# EAGLE design NinjaPCB_ver2.0 (EAGLE 6.6.0)
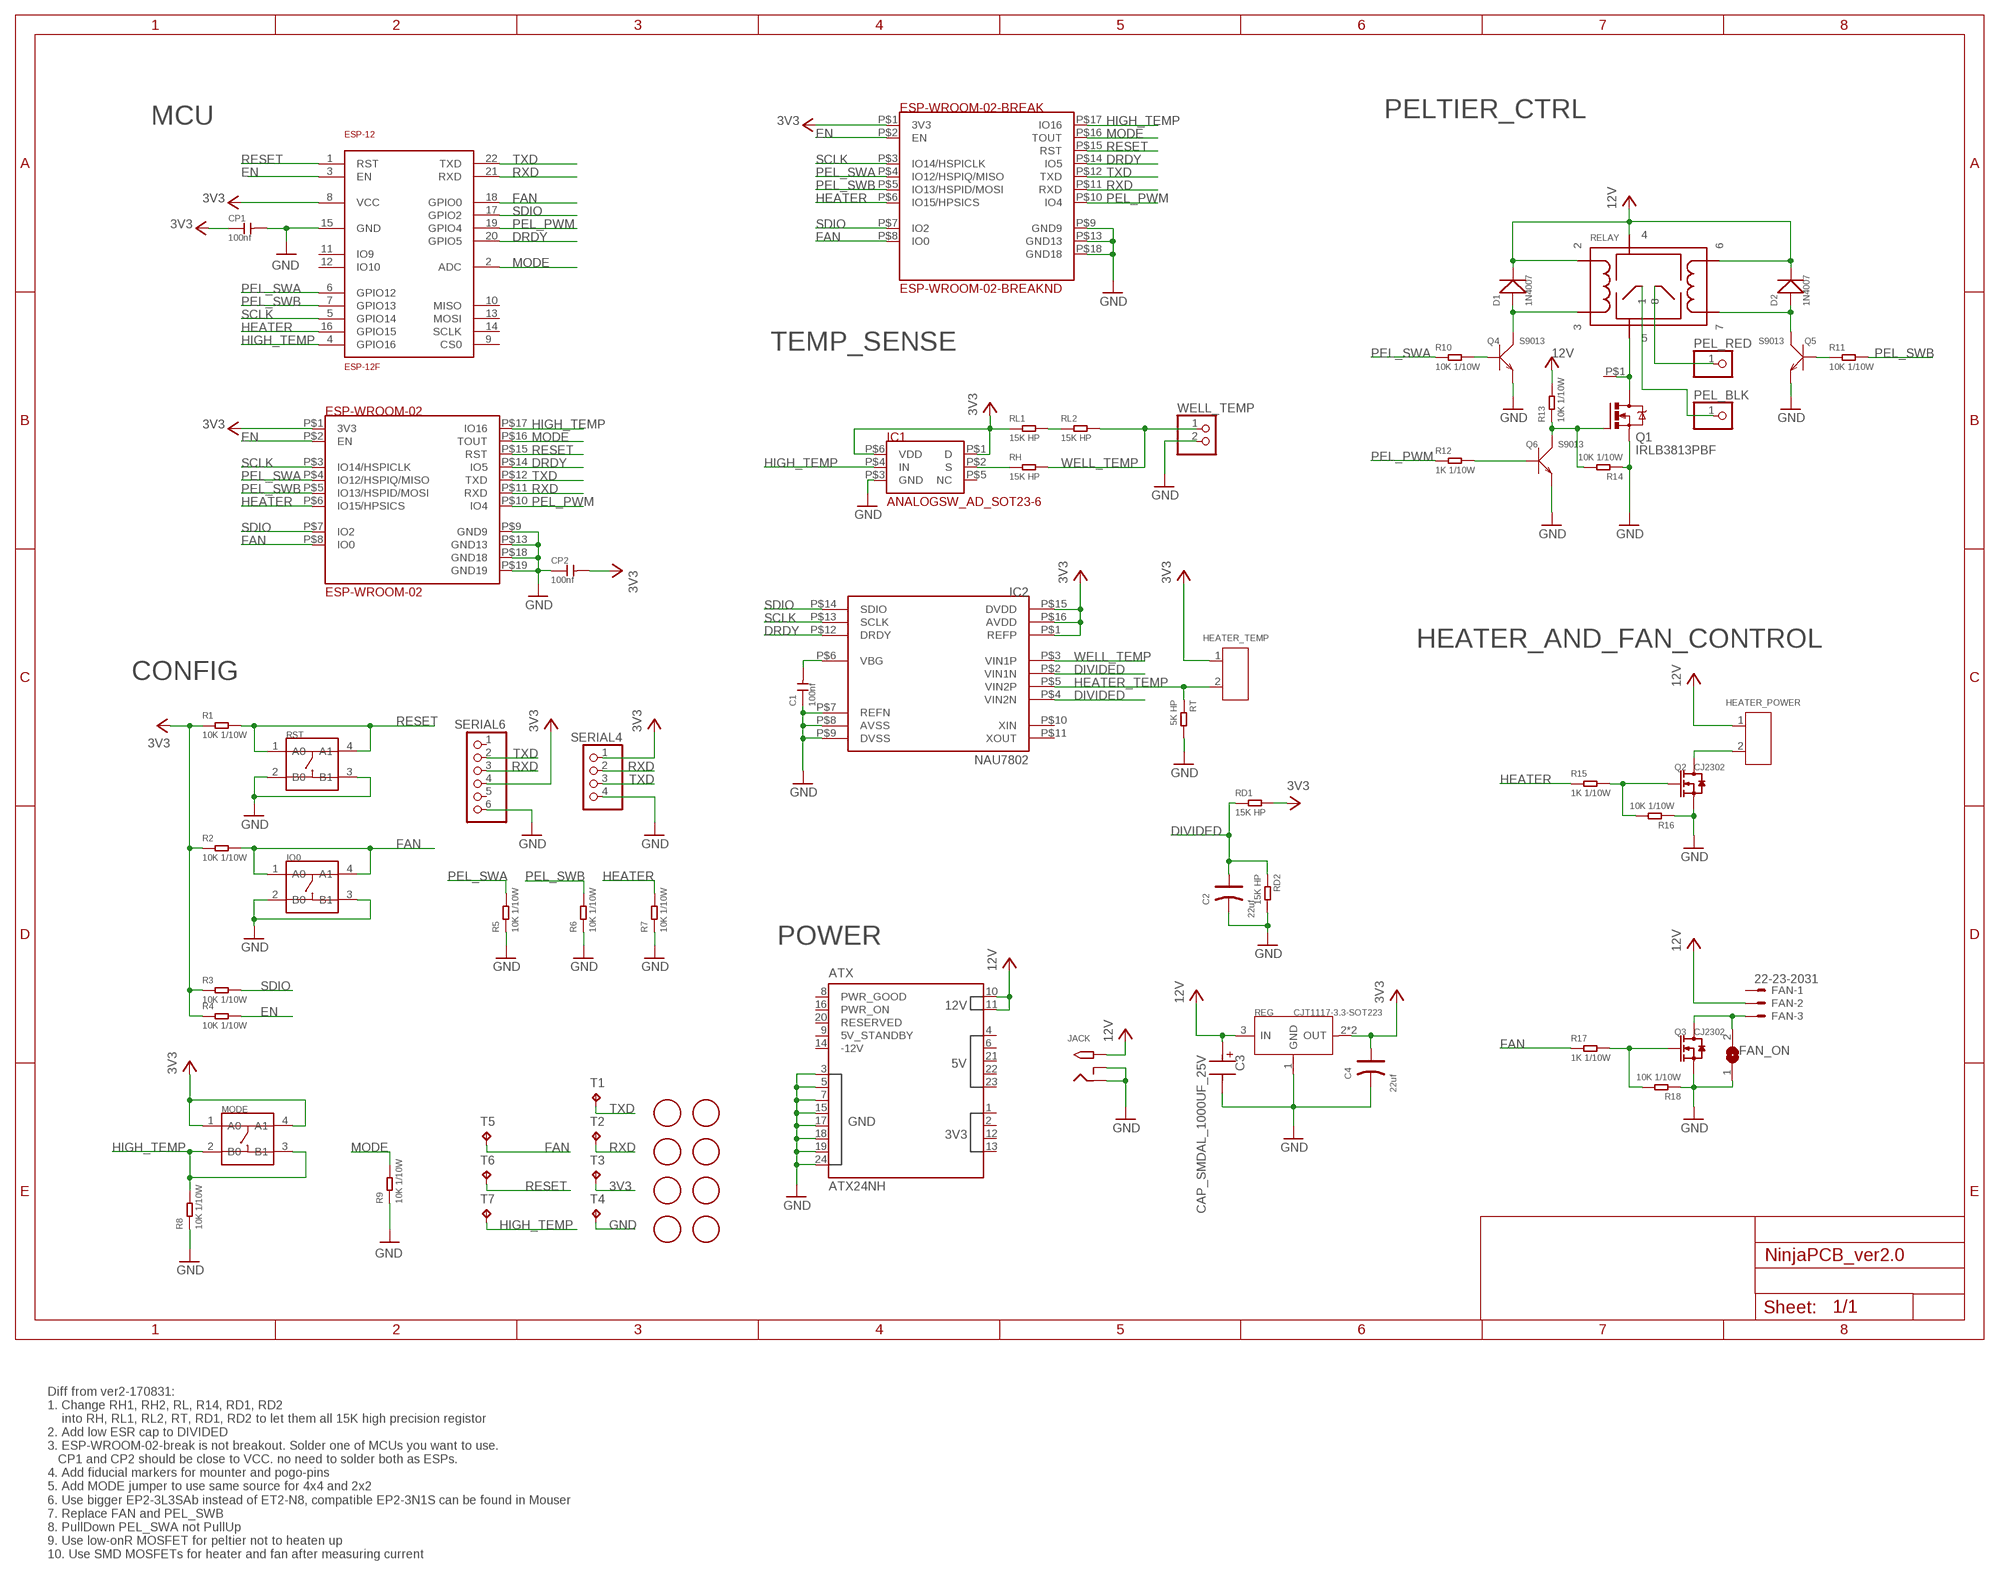
[diagram p0: schematic, sheet 1]

## Parts
ATX  ATX24NH  [ATX24]
C1  100nf  CERAMIC-100NF-50V-10%-X7R(0603)  [C0603]
C2  22uf  TANTALUM-SMD-22UF-16V(AVX-B)  [AVX-B]
C3  CAP_SMDAL_1000UF_25V  [CAP_SMD_AL_D125]
C4  22uf  TANTALUM-SMD-22UF-16V(AVX-B)  [AVX-B]
CP1  100nf  CERAMIC-100NF-50V-10%-X7R(0603)  [C0603]
CP2  100nf  CERAMIC-100NF-50V-10%-X7R(0603)  [C0603]
D1  1N4007  DIODE-GEN-PURPOSE-1KV-1A(DO-214AC)  [DO-214AC]
D2  1N4007  DIODE-GEN-PURPOSE-1KV-1A(DO-214AC)  [DO-214AC]
ESP-12  ESP-12F  [ESP-12F]
ESP-WROOM-02  ESP-WROOM-02  [ESP-WROOM-02]
ESP-WROOM-02-BREAK  ESP-WROOM-02-BREAKND  [ESP-WROOM-02-BREAK-NODETAIL]
FAN  22-23-2031  [22-23-2031]
FAN_ON  SJ  [SJ]
HEATER_POWER  SCREW-TERMINAL-GREEN(2P-3.5)  [H2-3.5-7.0X7.0MM]
HEATER_TEMP  SCREW-TERMINAL-GREEN(2P-3.5)  [H2-3.5-7.0X7.0MM]
HEATSINK  HEAT111PB015  [HEAT11PB015]
IC1  ANALOGSW_AD_SOT23-6  [SOT-23-6]
IC2  NAU7802  [SOP-16]
IO0  DIP-SWITCH-TACTILE-SPST-NO/TS-1109(4P-D6.0MM)'TS-1109'  [SW4-6.0X6.0X5.0MM]
JACK  2.1MMJACKTHM-NOOUT  [PJ-102A-NOOUT]
MODE  DIP-SWITCH-TACTILE-SPST-NO/TS-1109(4P-D6.0MM)'TS-1109'  [SW4-6.0X6.0X5.0MM]
PEL_BLK  PINHD-1X1L  [1X01LONG]
PEL_RED  PINHD-1X1L  [1X01LONG]
Q1  IRLB3813PBF  IRF520  [TO220BV]
Q2  CJ2302  SMD-MOSFET-N-CH-20V-2.1A-CJ2302(SOT-23)  [SOT-23]
Q3  CJ2302  SMD-MOSFET-N-CH-20V-2.1A-CJ2302(SOT-23)  [SOT-23]
Q4  S9013  SMD-TRANSISTORS-NPN-25V-500MA-S9013(SOT-23)  [SOT-23]
Q5  S9013  SMD-TRANSISTORS-NPN-25V-500MA-S9013(SOT-23)  [SOT-23]
Q6  S9013  SMD-TRANSISTORS-NPN-25V-500MA-S9013(SOT-23)  [SOT-23]
R1  10K 1/10W  SMD-RES-10K-5%-1/10W(0603)  [R0603]
R2  10K 1/10W  SMD-RES-10K-5%-1/10W(0603)  [R0603]
R3  10K 1/10W  SMD-RES-10K-5%-1/10W(0603)  [R0603]
R4  10K 1/10W  SMD-RES-10K-5%-1/10W(0603)  [R0603]
R5  10K 1/10W  SMD-RES-10K-5%-1/10W(0603)  [R0603]
R6  10K 1/10W  SMD-RES-10K-5%-1/10W(0603)  [R0603]
R7  10K 1/10W  SMD-RES-10K-5%-1/10W(0603)  [R0603]
R8  10K 1/10W  SMD-RES-10K-5%-1/10W(0603)  [R0603]
R9  10K 1/10W  SMD-RES-10K-5%-1/10W(0603)  [R0603]
R10  10K 1/10W  SMD-RES-10K-5%-1/10W(0603)  [R0603]
R11  10K 1/10W  SMD-RES-10K-5%-1/10W(0603)  [R0603]
R12  1K 1/10W  SMD-RES-1K-5%-1/10W(0603)  [R0603]
R13  10K 1/10W  SMD-RES-10K-5%-1/10W(0603)  [R0603]
R14  10K 1/10W  SMD-RES-10K-5%-1/10W(0603)  [R0603]
R15  1K 1/10W  SMD-RES-1K-5%-1/10W(0603)  [R0603]
R16  10K 1/10W  SMD-RES-10K-5%-1/10W(0603)  [R0603]
R17  1K 1/10W  SMD-RES-1K-5%-1/10W(0603)  [R0603]
R18  10K 1/10W  SMD-RES-10K-5%-1/10W(0603)  [R0603]
RD1  15K HP  R0603  [R0603]
RD2  15K HP  R0603  [R0603]
REG  CJT1117-3.3-SOT223  PMIC-CJT1117-3.3(SOT223)  [SOT-223]
RELAY  NEC-RELAY2EN2  [NEC-EN2]
RH  15K HP  R0603  [R0603]
RL1  15K HP  R0603  [R0603]
RL2  15K HP  R0603  [R0603]
RST  DIP-SWITCH-TACTILE-SPST-NO/TS-1109(4P-D6.0MM)'TS-1109'  [SW4-6.0X6.0X5.0MM]
RT  5K HP  SMD-RES-2K-1%-1/10W(0603)  [R0603]
SERIAL4  PINHD-1X4  [1X04]
SERIAL6  PINHD-1X6  [1X06]
T1  TPTP20R  [TP20R]
T2  TPTP20R  [TP20R]
T3  TPTP20R  [TP20R]
T4  TPTP20R  [TP20R]
T5  TPTP20R  [TP20R]
T6  TPTP20R  [TP20R]
T7  TPTP20R  [TP20R]
U$3  FIDUCIAL  [FIDUCIAL_1MM]
U$4  FIDUCIAL  [FIDUCIAL_1MM]
U$5  FIDUCIAL  [FIDUCIAL_1MM]
U$6  FIDUCIAL  [FIDUCIAL_1MM]
U$7  FIDUCIAL  [FIDUCIAL_1MM]
U$8  FIDUCIAL  [FIDUCIAL_1MM]
U$9  FIDUCIAL  [FIDUCIAL_1MM]
U$10  FIDUCIAL  [FIDUCIAL_1MM]
WELL_TEMP  PINHD-1X2  [1X02]

## Nets
3V3: C4.+ CP1.1 CP2.2 ESP-12.8(VCC) ESP-WROOM-02-BREAK.P$1(3V3) ESP-WROOM-02.P$1(3V3) HEATER_TEMP.1 IC1.P$1(D) IC1.P$6(VDD) IC2.P$1(REFP) IC2.P$15(DVDD) IC2.P$16(AVDD) MODE.1(A0) MODE.4(A1) R1.1 R2.1 R3.1 R4.1 RD1.2 REG.2(OUT) REG.TER(OUT) RL1.1 SERIAL4.1 SERIAL6.4 T3.TP
12V: ATX.10(12V_10) ATX.11(12V_11) C3.P$P D1.2(-) D2.2(-) FAN.2 HEATER_POWER.1 JACK.TIP R13.2 REG.3(IN) RELAY.P$2 RELAY.P$4 RELAY.P$6
DIVIDED: C2.+ IC2.P$2(VIN1N) IC2.P$4(VIN2N) RD1.1 RD2.1
DRDY: ESP-12.20(GPIO5) ESP-WROOM-02-BREAK.P$14(IO5) ESP-WROOM-02.P$14(IO5) IC2.P$12(DRDY)
EN: ESP-12.3(EN) ESP-WROOM-02-BREAK.P$2(EN) ESP-WROOM-02.P$2(EN) R4.2
FAN: ESP-12.18(GPIO0) ESP-WROOM-02-BREAK.P$8(IO0) ESP-WROOM-02.P$8(IO0) IO0.1(A0) IO0.4(A1) R2.2 R17.1 T5.TP
GND: ATX.3(GND3) ATX.5(GND5) ATX.7(GND7) ATX.15(GND15) ATX.17(GND17) ATX.18(GND18) ATX.19(GND19) ATX.24(GND24) C1.1 C2.- C3.P$M C4.- CP1.2 CP2.1 ESP-12.15(GND) ESP-WROOM-02-BREAK.P$9(GND9) ESP-WROOM-02-BREAK.P$13(GND13) ESP-WROOM-02-BREAK.P$18(GND18) ESP-WROOM-02.P$9(GND9) ESP-WROOM-02.P$13(GND13) ESP-WROOM-02.P$18(GND18) ESP-WROOM-02.P$19(GND19) FAN_ON.1 IC1.P$3(GND) IC2.P$7(REFN) IC2.P$8(AVSS) IC2.P$9(DVSS) IO0.2(B0) IO0.3(B1) JACK.RING JACK.RING_SW Q1.S Q2.2(S) Q3.2(S) Q4.2(E) Q5.2(E) Q6.2(E) R5.1 R6.1 R7.1 R8.1 R9.1 R14.1 R16.1 R18.1 RD2.2 REG.1(GND) RST.2(B0) RST.3(B1) RT.2 SERIAL4.4 SERIAL6.6 T4.TP WELL_TEMP.2
HEATER: ESP-12.16(GPIO15) ESP-WROOM-02-BREAK.P$6(IO15/HPSICS) ESP-WROOM-02.P$6(IO15/HPSICS) R7.2 R15.1
HEATER_TEMP: HEATER_TEMP.2 IC2.P$5(VIN2P) RT.1
HIGH_TEMP: ESP-12.4(GPIO16) ESP-WROOM-02-BREAK.P$17(IO16) ESP-WROOM-02.P$17(IO16) IC1.P$4(IN) MODE.2(B0) MODE.3(B1) R8.2 T7.TP
MODE: ESP-12.2(ADC) ESP-WROOM-02-BREAK.P$16(TOUT) ESP-WROOM-02.P$16(TOUT) R9.2
N$1: RL1.2 RL2.1
N$2: HEATER_POWER.2 Q2.3(D)
N$3: HEATSINK.P$1 Q1.D RELAY.P$5
N$4: FAN.3 FAN_ON.2 Q3.3(D)
N$5: Q1.G Q6.3(C) R13.1 R14.2
N$6: PEL_RED.1 RELAY.P$8
N$7: PEL_BLK.1 RELAY.P$1
N$8: Q3.1(G) R17.2 R18.2
N$27: IC1.P$2(S) RH.1
N$30: Q6.1(B) R12.2
N$32: Q2.1(G) R15.2 R16.2
N$33: D1.1(+) Q4.3(C) RELAY.P$3
N$34: Q4.1(B) R10.2
N$35: Q5.1(B) R11.1
N$36: D2.1(+) Q5.3(C) RELAY.P$7
N$92: C1.2 IC2.P$6(VBG)
PEL_PWM: ESP-12.19(GPIO4) ESP-WROOM-02-BREAK.P$10(IO4) ESP-WROOM-02.P$10(IO4) R12.1
PEL_SWA: ESP-12.6(GPIO12) ESP-WROOM-02-BREAK.P$4(IO12/HSPIQ/MISO) ESP-WROOM-02.P$4(IO12/HSPIQ/MISO) R5.2 R10.1
PEL_SWB: ESP-12.7(GPIO13) ESP-WROOM-02-BREAK.P$5(IO13/HSPID/MOSI) ESP-WROOM-02.P$5(IO13/HSPID/MOSI) R6.2 R11.2
RESET: ESP-12.1(RST) ESP-WROOM-02-BREAK.P$15(RST) ESP-WROOM-02.P$15(RST) R1.2 RST.1(A0) RST.4(A1) T6.TP
RXD: ESP-12.21(RXD) ESP-WROOM-02-BREAK.P$11(RXD) ESP-WROOM-02.P$11(RXD) SERIAL4.2 SERIAL6.3 T2.TP
SCLK: ESP-12.5(GPIO14) ESP-WROOM-02-BREAK.P$3(IO14/HSPICLK) ESP-WROOM-02.P$3(IO14/HSPICLK) IC2.P$13(SCLK)
SDIO: ESP-12.17(GPIO2) ESP-WROOM-02-BREAK.P$7(IO2) ESP-WROOM-02.P$7(IO2) IC2.P$14(SDIO) R3.2
TXD: ESP-12.22(TXD) ESP-WROOM-02-BREAK.P$12(TXD) ESP-WROOM-02.P$12(TXD) SERIAL4.3 SERIAL6.2 T1.TP
WELL_TEMP: IC2.P$3(VIN1P) RH.2 RL2.2 WELL_TEMP.1
Unconnected: ATX.1(3V3_1) ATX.2(3V3_2) ATX.4(5V_4) ATX.6(5V_6) ATX.8(PWR_GOOD) ATX.9(5V_STANDBY) ATX.12(3V3_12) ATX.13(3V3_13) ATX.14(-12V) ATX.16(PWR_ON) ATX.20(RESERVED) ATX.21(5V_21) ATX.22(5V_22) ATX.23(5V_23) ESP-12.9(CS0) ESP-12.10(MISO) ESP-12.11(IO9) ESP-12.12(IO10) ESP-12.13(MOSI) ESP-12.14(SCLK) FAN.1 IC1.P$5(NC) IC2.P$10(XIN) IC2.P$11(XOUT) SERIAL6.1 SERIAL6.5

## Notes on the sheet
- MCU | PELTIER_CTRL
- TEMP_SENSE
- HEATER_AND_FAN_CONTROL
- CONFIG
- POWER
- Diff from ver2-170831: 
  1. Change RH1, RH2, RL, R14, RD1, RD2 
      into RH, RL1, RL2, RT, RD1, RD2 to let them all 15K high precision registor
  2. Add low ESR cap to DIVIDED
  3. ESP-WROOM-02-break is not breakout. Solder one of MCUs you want to use.
     CP1 and CP2 should be close to VCC. no need to solder both as ESPs.
  4. Add fiducial markers for mounter and pogo-pins
  5. Add MODE jumper to use same source for 4x4 and 2x2
  6. Use bigger EP2-3L3SAb instead of ET2-N8, compatible EP2-3N1S can be found in Mouser
  7. Replace FAN and PEL_SWB
  8. PullDown PEL_SWA not PullUp
  9. Use low-onR MOSFET for peltier not to heaten up
  10. Use SMD MOSFETs for heater and fan after measuring current

## Library data of the parts
ATX = PCR-Connector:ATX24
C1 CP1 CP2 = Seeed-Capacitor:CERAMIC-100NF-50V-10%-X7R(0603): 302010138; MPN: CC0603KRX7R9BB104
C2 C4 = Seeed-Capacitor:TANTALUM-SMD-22UF-16V(AVX-B): 302020013; MPN: TAJB226*016#NJ
C3 = Seeed-OPL-2017-01-Capacitor-akita:CAP_SMDAL_1000UF_25V: SMD CAP Aluminum 1000uF-25V;D12.5*H13.5mm SKU: 302030098
D1 D2 = Seeed-Diode:DIODE-GEN-PURPOSE-1KV-1A(DO-214AC): 304010013; MPN: 1N4007
ESP-12 = Seeed-OPL-2017-01-Sensor-camilo:ESP-12F: 317060163
ESP-WROOM-02 = PCR-Module:ESP-WROOM-02
ESP-WROOM-02-BREAK = PCR-Module:ESP-WROOM-02-BREAK
FAN = con-molex:22-23-2031: .100" (2.54mm) Center Header - 3 Pin; MF: MOLEX; MPN: 22-23-2031; OC_FARNELL: 1462950; OC_NEWARK: 30C0862
FAN_ON = jumper:SJ: SMD solder JUMPER
HEATER_POWER HEATER_TEMP = Seeed-Connector:SCREW-TERMINAL-GREEN(2P-3.5): 320110028; VALUE: GREEN-2P-3.5
HEATSINK = PCR-Connector:HEAT1
IC1 = PCR-IC:ANALOGSW_AD_SOT23-6
IC2 = PCR-IC:NAU7802
IO0 MODE RST = Seeed-Switch:DIP-SWITCH-TACTILE-SPST-NO/TS-1109(4P-D6.0MM): 311020024
JACK = adafruit:2.1MMJACK: 2.1mm x 5.5mm THM DC jack with internal switch. Digikey part #PJ-102A, 4UCON part #05537 2.1mm x 5.5mm SMT DC jack with internal switch. Digikey part #PJ-002A-SMT, 4UCON part #03267 By microbuilder.eu & adafruit.com
PEL_BLK PEL_RED = pinhead:PINHD-1X1: PIN HEADER
Q1 = transistor-power:IRF520: HEXFET Power MOSFET
Q2 Q3 = Seeed-Transistor:SMD-MOSFET-N-CH-20V-2.1A-CJ2302(SOT-23): 305030015; MPN: CJ2302
Q4-Q6 = Seeed-Transistor:SMD-TRANSISTORS-NPN-25V-500MA-S9013(SOT-23): 305010018; MPN: S9013
R1-R11 R13 R14 R16 R18 = Seeed-Resistor:SMD-RES-10K-5%-1/10W(0603): 301010293; MPN: RC0603JR-0710KL
R12 R15 R17 = Seeed-Resistor:SMD-RES-1K-5%-1/10W(0603): 301010291; MPN: RC0603JR-071KL
RD1 RD2 RH RL1 RL2 = PCR-RCL:R
REG = Seeed-IC:PMIC-CJT1117-3.3(SOT223): 310030097; MPN: CJT1117-3.3
RELAY = PCR-Switch:NEC-RELAY2
RT = Seeed-Resistor:SMD-RES-2K-1%-1/10W(0603): 301010221; MPN: RC0603FR-072KL; VALUE: 2K
SERIAL4 = pinhead:PINHD-1X4: PIN HEADER
SERIAL6 = pinhead:PINHD-1X6: PIN HEADER
T1-T7 = testpad:TP: Test pad
U$3-U$10 = adafruit:FIDUCIAL: For use by pick and place machines to calibrate the vision/machine, 1mm By microbuilder.eu
WELL_TEMP = pinhead:PINHD-1X2: PIN HEADER

## Net classes
1 2A: width 0.406 mm
2 8A: width 2.54 mm

## Board
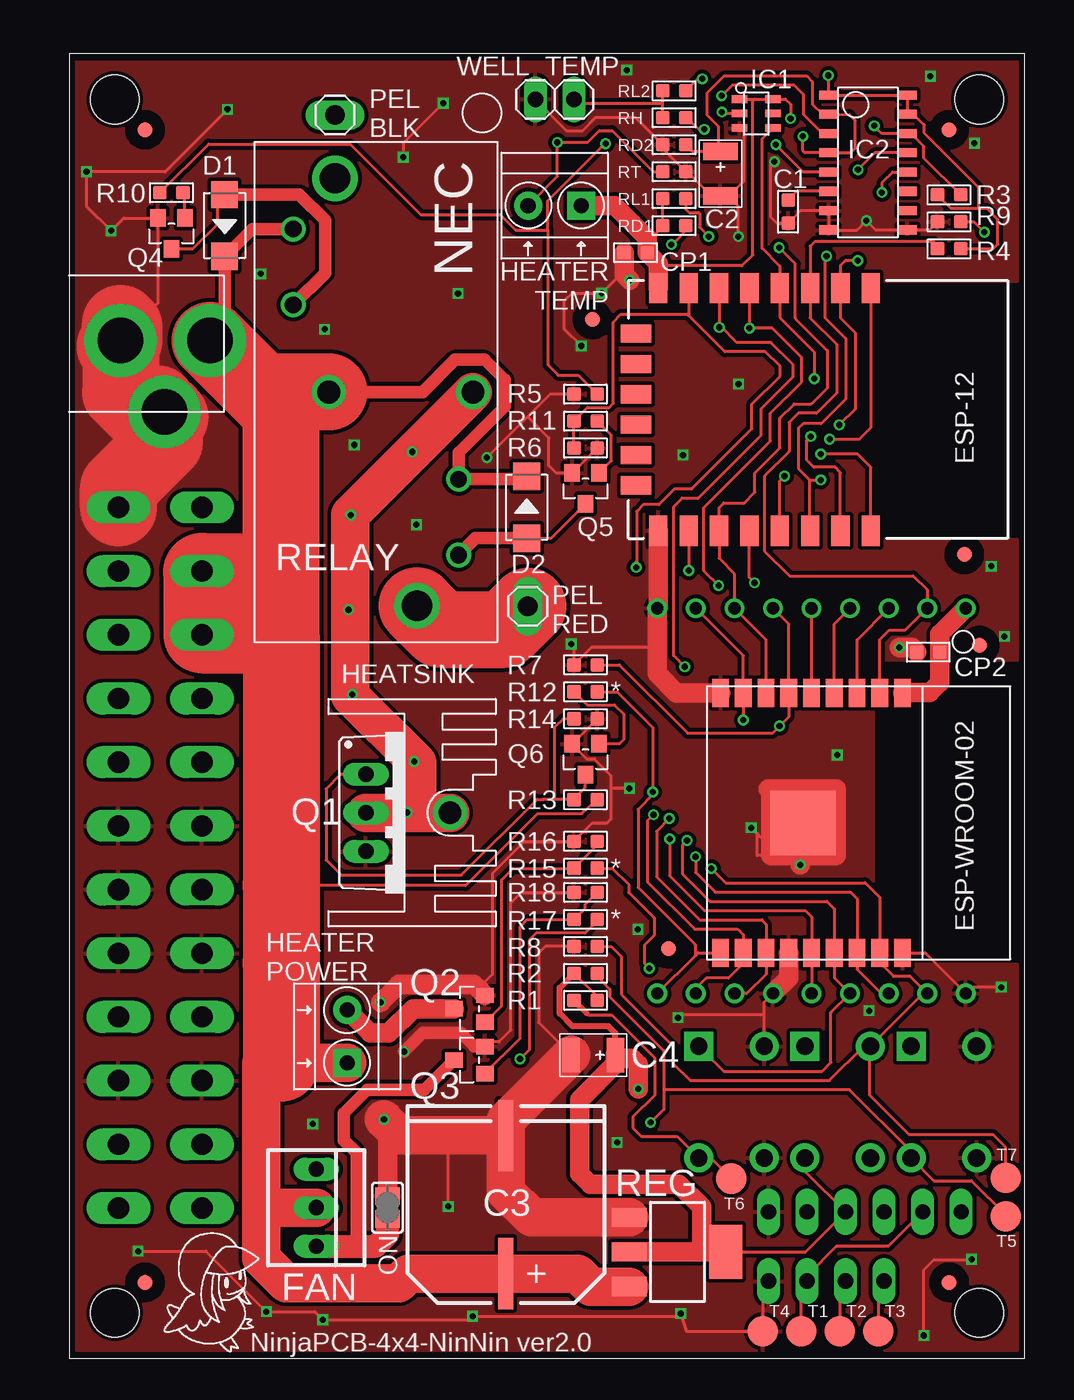
[diagram p1: board, top side]
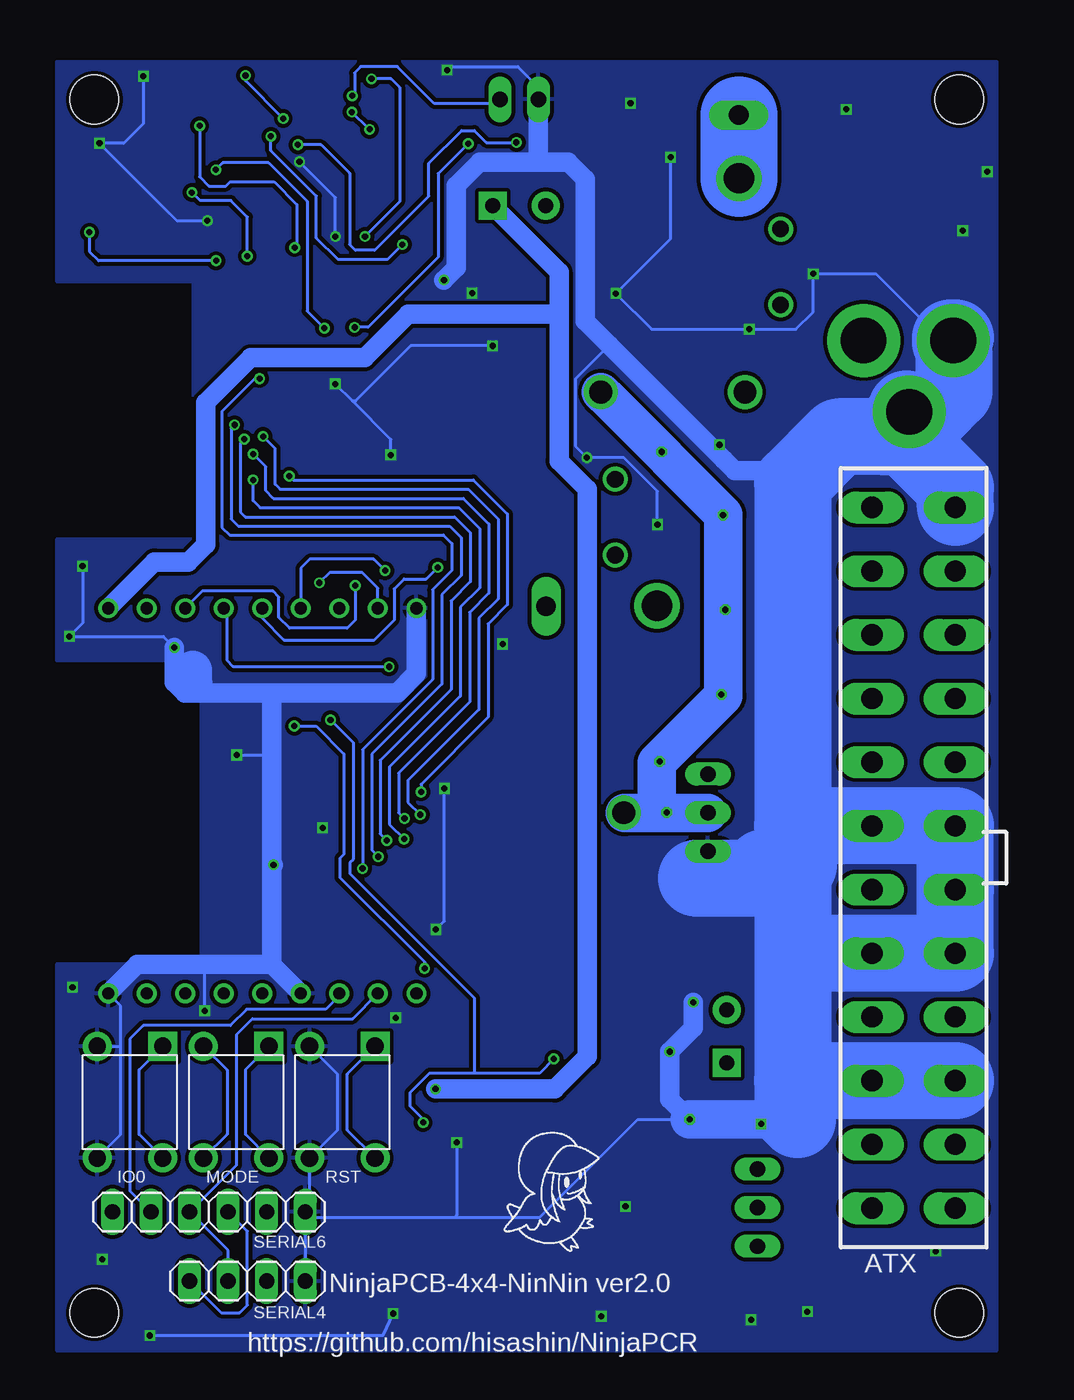
[diagram p2: board, bottom side, seen from below]

No outline drawn. Coordinates in mm, seen from the top.
Copper layers (1*16): Top 0.035mm / dielectric 1.5mm / Bottom 0.035mm
Design rules "SeeedStudio_2layer_DRU_no_angle_20140221": minimum track width 6mil, minimum drill 12mil, track to track 6mil, track to pad 6mil, pad to pad 6mil, via to via 6mil, smd to smd 0mil, copper to edge 10mil, drill to drill 10mil, minimum pad ring 10mil, minimum via ring 6mil, stop-mask expansion 2mil, vias tented up to drill 100mil, thermal gap 10mil
Holes 3.2 mm at 3,3 60,3 60,83 3,83

### Footprints (pad centres in the part's own frame; a part is rotated, then mirrored left to right if it is on the bottom)
ATX24 = drill 1.4 long: 1 23.1,-2.75; 2 18.9,-2.75; 3 14.7,-2.75; 4 10.5,-2.75; 5 6.3,-2.75; 6 2.1,-2.75; 7 -2.1,-2.75; 8 -6.3,-2.75; 9 -10.5,-2.75; 10 -14.7,-2.75; 11 -18.9,-2.75; 12 -23.1,-2.75; 13 23.1,2.75; 14 18.9,2.75; 15 14.7,2.75; 16 10.5,2.75; 17 6.3,2.75; 18 2.1,2.75; 19 -2.1,2.75; 20 -6.3,2.75; 21 -10.5,2.75; 22 -14.7,2.75; 23 -18.9,2.75; 24 -23.1,2.75
C0603 = smd 0.889 x 0.889: 1 0,0.762; 2 0,-0.762
AVX-B = smd 1.143 x 2.286: + -1.46,0; - 1.46,0
CAP_SMD_AL_D125 = smd 1 x 4.7: P$M 0,-4.55; P$P 0,4.55
DO-214AC = smd 1.8 x 1.77: 1 -2.042,0; 2 2.042,0
ESP-12F = smd 2 x 1.2: 1 -8,3.48; 2 -8,1.48; 3 -8,-0.52; 4 -8,-2.52; 5 -8,-4.52; 6 -8,-6.52; 7 -8,-8.52; 8 -8,-10.52; 15 8,-10.52; 16 8,-8.52; 17 8,-6.52; 18 8,-4.52; 19 8,-2.52; 20 8,-0.52; 21 8,1.48; 22 8,3.48 | smd 1.2 x 2: 9 -5,-12; 10 -3,-12; 11 -1,-12; 12 1,-12; 13 3,-12; 14 5,-12
ESP-WROOM-02 = smd 1.85 x 1.1: P$1 -8.575,12.9; P$2 -8.575,11.4; P$3 -8.575,9.9; P$4 -8.575,8.4; P$5 -8.575,6.9; P$6 -8.575,5.4; P$7 -8.575,3.9; P$8 -8.575,2.4; P$9 -8.575,0.9; P$10 8.575,0.9; P$11 8.575,2.4; P$12 8.575,3.9; P$13 8.575,5.4; P$14 8.575,6.9; P$15 8.575,8.4; P$16 8.575,9.9; P$17 8.575,11.4; P$18 8.575,12.9 | smd 4.3 x 4.3: P$19 0,6.33
ESP-WROOM-02-BREAK-NODETAIL = drill 0.8: P$1 -12.7,10.16; P$2 -12.7,7.62; P$3 -12.7,5.08; P$4 -12.7,2.54; P$5 -12.7,0; P$6 -12.7,-2.54; P$7 -12.7,-5.08; P$8 -12.7,-7.62; P$9 -12.7,-10.16; P$10 12.7,-10.16; P$11 12.7,-7.62; P$12 12.7,-5.08; P$13 12.7,-2.54; P$14 12.7,0; P$15 12.7,2.54; P$16 12.7,5.08; P$17 12.7,7.62; P$18 12.7,10.16
22-23-2031 = drill 1 long: 1 -2.54,0; 2 0,0; 3 2.54,0
SJ = smd 1.168 x 1.6: 1 -0.762,0; 2 0.762,0
H2-3.5-7.0X7.0MM = drill 1 pad 1.85 square: 1 -1.75,0 | drill 1 pad 1.85: 2 1.75,0
HEAT11PB015 = drill 1.5: P$1 0,3
SOT-23-6 = smd 0.5 x 1: P$1 -0.95,-1.1; P$2 0,-1.1; P$3 0.95,-1.1; P$4 0.95,1.1; P$5 0,1.1; P$6 -0.95,1.1
SOP-16 = smd 0.6 x 1.2: P$1 -4.445,-2.6; P$2 -3.175,-2.6; P$3 -1.905,-2.6; P$4 -0.635,-2.6; P$5 0.635,-2.6; P$6 1.905,-2.6; P$7 3.175,-2.6; P$8 4.445,-2.6; P$9 4.445,2.6; P$10 3.175,2.6; P$11 1.905,2.6; P$12 0.635,2.6; P$13 -0.635,2.6; P$14 -1.905,2.6; P$15 -3.175,2.6; P$16 -4.445,2.6
SW4-6.0X6.0X5.0MM = drill 1.143 pad 1.905 square: 1 -3.683,2.159 | drill 1.143 pad 1.905: 2 -3.683,-2.159; 3 3.683,-2.159; 4 3.683,2.159
PJ-102A-NOOUT = drill 3 pad 4.8: RING 0.1,-3.39; RING_SW -4.6,-6.29; TIP 0.1,-9.29
1X01LONG = drill 1.3 long: 1 0,0
TO220BV = drill 1.016 long: D 0,-2.54; G -2.54,-2.54; S 2.54,-2.54
SOT-23 = smd 1.016 x 1.143: 1 -0.889,-1.016; 2 0.889,-1.016; 3 0,1.016
R0603 = smd 0.889 x 0.889: 1 0,0.762; 2 0,-0.762
SOT-223 = smd 1.27 x 2.286: 1 -2.286,-3.175; 2 0,-3.175; 3 2.286,-3.175 | smd 3.556 x 2.159: TER 0,3.175
NEC-EN2 = drill 2: P$1 -14.1,-2.7; P$8 14.1,2.7 | drill 1.1: P$2 -10.75,-5.45; P$3 -5.75,-5.45; P$6 5.75,5.45; P$7 10.75,5.45 | drill 1.5: P$4 0,-3.1; P$5 0,6.4
1X04 = drill 1.016 long: 1 -3.81,0; 2 -1.27,0; 3 1.27,0; 4 3.81,0
1X06 = drill 1.016 long: 1 -6.35,0; 2 -3.81,0; 3 -1.27,0; 4 1.27,0; 5 3.81,0; 6 6.35,0
TP20R = smd 2 x 2: TP 0,0
FIDUCIAL_1MM = smd 1 x 1: 1 0,0
1X02 = drill 1.016 long: 1 -1.27,0; 2 1.27,0

### Placement (x,y rotation side)
ATX  6,33 270 bottom
C1  47.39,75.6 180 top
C2  42.93,78.11 270 top
C3  28.79,10.13 180 top
C4  34.54,19.99 180 top
CP1  37.34,72.9 270 top
CP2  56.63,46.56 90 top
D1  10.24,74.68 270 top
D2  30.15,56.11 90 top
ESP-12  49.36,62.56 270 top
ESP-WROOM-02  42.03,35.3 270 top
ESP-WROOM-02-BREAK  48.93,36.75 270 top
FAN  16.29,9.93 270 top
FAN_ON  20.98,9.93 270 top
HEATER_POWER  18.32,21.22 90 top
HEATER_TEMP  32,76 180 top
HEATSINK  22.11,35.97 270 top
IC1  45.29,82.07 270 top
IC2  52.65,78.84 270 top
IO0  57.66,16.89 270 bottom
JACK  0,67 90 top
MODE  50.66,16.89 270 bottom
PEL_BLK  17.53,81.98 0 top
PEL_RED  30.23,49.58 270 top
Q1  22.11,35.97 270 top
Q2  26.39,23.04 90 top
Q3  26.39,19.66 90 top
Q4  6.74,74.16 180 top
Q5  34.04,57.35 180 top
Q6  34.04,39.5 180 top
R1  34.04,23.6 270 top
R2  34.04,25.37 90 top
R3  58,76.71 90 top
R4  58,73.15 270 top
R5  34.04,63.58 90 top
R6  34.04,60.02 270 top
R7  34.04,45.72 90 top
R8  34.04,27.15 90 top
R9  58,74.93 90 top
R10  6.74,76.85 90 top
R11  34.04,61.8 270 top
R12  34.04,43.94 270 top
R13  34.04,36.83 90 top
R14  34.04,42.16 270 top
R15  34.04,32.31 270 top
R16  34.04,34.09 90 top
R17  34.04,28.93 270 top
R18  34.04,30.71 90 top
RD1  39.88,74.68 270 top
RD2  39.88,80.01 270 top
REG  40.1,7.01 270 top
RELAY  20.22,63.7 270 top
RH  39.88,81.79 270 top
RL1  39.88,76.45 90 top
RL2  39.88,83.57 270 top
RST  43.66,16.89 270 bottom
RT  39.88,78.23 90 top
SERIAL4  49.91,5.08 0 bottom
SERIAL6  52.45,9.65 0 bottom
T1  48.26,1.78 0 top
T2  50.8,1.78 0 top
T3  53.34,1.78 0 top
T4  45.72,1.78 0 top
T5  61.72,9.35 0 top
T6  43.66,11.84 0 top
T7  61.72,11.89 0 top
U$1  [TORI_0.25]  6.1,0.28 0 top
U$2  [TORI_0.25]  33.15,6.91 0 bottom
U$3  58,5 0 top
U$4  58,81 0 top
U$5  5,5 0 top
U$6  5,81 0 top
U$7  59,53 0 top
U$8  34.5,68.5 0 top
U$9  60,47 0 top
U$10  39.5,27 0 top
WELL_TEMP  32,83 180 top

### Tracks (layer width: path | path; a pad name or v marks a point on that pad's centre or on a via)
3V3  (via drill 0.4)
  Top 0.203: IC1.P$1 45.16,83.02 | 45.16,83.02 IC1.P$6 47.21,83.02 47.55,82.68 v47.55,81.74 | ESP-12.8 38.84,70.68 38.77,70.76 | 39.12,74.78 RD1.2 39.12,74.6 38.38,73.86 38.1,73.86 | 39.12,74.78 RL1.1 | ESP-WROOM-02.P$1 54.95,43.89 | R3.1 58.12,75.82 59.92,75.82 | 39.12,74.78 39.01,74.68 | R2.1 34.8,23.85 R1.1 | REG.TER 48.54,7.01 SERIAL6.4 48.5,12.34 MODE.4 | SERIAL4.1 53.34,4.7 T3.TP | 59.92,75.82 60.48,75.82 61.21,75.08 61.21,73.46 60.91,73.15 R4.1 | 38.84,72.03 44.35,72.03 45.06,72.75 45.06,82.92 45.16,83.02 | v50.04,84.58 50.05,84.57 IC2.P$1 IC2.P$16 IC2.P$15 55.65,82.02 56.36,81.31 56.36,80.77 59.92,77.22 59.92,75.82
  Top 0.381: C4.+ 36.01,21.43 35.53,21.89 33.17,21.89 32.33,22.73 32.33,24.43 R2.1
  Top 1.27: REG.2 41.45,7.01 | 41.45,7.01 REG.TER | 41.45,7.01 41.68,7.24 41.68,9.98 40.18,11.48 34.34,11.48 33.66,12.17 33.66,17.04 36.01,19.39 C4.+ 36.21,19.79 37.11,19.79 37.52,19.38 v37.52,17.75 | ESP-WROOM-02-BREAK.P$1 57.39,47.75 CP2.2 57.39,44.55 56.73,43.89 54.95,43.89 ESP-WROOM-02.P$1 | ESP-12.8 38.84,72.03 38.84,72.16 CP1.1 38.1,73.86 35.96,76 HEATER_TEMP.1
  Bottom 0.203: SERIAL4.1 51.64,3 50.42,3 49.91,3.5 49.91,8.38 SERIAL6.4 | v47.55,81.74 50.04,84.23 v50.04,84.58 | MODE.4 50.04,14.75 50.04,19.03 MODE.1
  Bottom 1.27: HEATER_TEMP.1 29.36,71.61 29.36,68.81 | 29.36,68.81 29.36,59.16 27.51,57.3 27.51,19.89 29.64,17.75 v37.52,17.75 | ESP-WROOM-02-BREAK.P$1 56.04,52.5 53.8,52.5 52.65,53.65 52.65,63.02 49.71,65.96 42.19,65.96 39.32,68.83 29.39,68.83 29.36,68.81
12V
  Top 0.203: R13.2 33.8,35.91 30.88,35.91 26.14,31.17 15.88,31.17 15.82,31.22 13.99,31.22 13.97,31.19 | 15.9,25.12 14.96,26.06 14.73,26.06 | 14.73,26.06 13.97,26.06 | 14.73,26.06 15.29,25.5 15.54,25.75 | ATX.11 8.74,51.89 8.74,51.87
  Top 0.813: RELAY.P$2 12.06,74.45 D1.2 10.24,68.05 JACK.TIP | RELAY.P$4 23.29,63.7 25.43,65.84 27.38,65.84 28.7,64.52 28.7,62.74 25.67,59.7 RELAY.P$6 29.95,57.95 D2.2
  Top 2.54: HEATER_POWER.1 14.9,19.47 14.83,19.53 14.05,19.53 13.97,19.46 12.68,19.46 12.68,9.83 | REG.3 34.37,4.73 33.51,5.58 C3.P$P 22.35,5.58 21.72,4.95 14.3,4.95 12.68,6.58 12.68,9.83 | FAN.2 12.78,9.93 12.68,9.83
  Top 5.08: 13.97,47.7 13.97,31.19 13.97,26.06 13.97,19.46 | ATX.11 ATX.10 13.97,47.7 | 8.74,51.87 12.7,51.87 12.7,51.82 | 13.97,47.7 13.97,62.42 JACK.TIP 12.69,63.7 RELAY.P$4
DIVIDED  (via drill 0.4)
  Top 0.203: RD1.1 40.82,74.5 39.75,73.43 v39.7,73.43 | RD2.1 41.08,79.57 C2.+ 42.8,79.69 42.8,81.23 42.04,81.99 42.04,83.41 43.18,84.56 48.62,84.56 49,84.18 49,82.68 49.66,82.02 IC2.P$2 51.43,82 51.79,81.64 51.79,79.76 51.49,79.45 50.32,79.45 IC2.P$4 48.51,79.48 48.36,79.63 v48.36,80.57
  Bottom 0.203: v39.7,73.43 40.69,72.44 43.94,72.44 45.36,73.86 45.36,76.63 48.36,79.63 v48.36,80.57
DRDY  (via drill 0.4)
  Top 0.203: ESP-WROOM-02-BREAK.P$14 ESP-WROOM-02.P$14 48.93,29.11 48.52,29.52 41.87,29.52 39.58,31.8 v39.58,34.24 | 48.8,54.52 ESP-12.20 48.83,57.91 | 48.83,57.91 48.07,58.67 48.07,61.32 48.37,61.62 49.57,61.62 51.19,63.25 51.19,67.23 49.84,68.58 49.84,72.59 v49.92,72.67 | 48.83,57.91 v49.54,57.91 | IC2.P$12 54.28,78.21 53.57,77.5 v53.57,76.86
  Bottom 0.203: v49.54,57.91 49.54,56.54 49.08,56.08 35.98,56.08 34.6,54.71 34.6,50.8 35.88,49.53 35.88,43.66 40.55,38.99 40.55,35.2 v39.58,34.24 | v49.92,72.67 49.92,75.25 51,76.33 53.03,76.33 v53.57,76.86
EN
  Top 0.203: ESP-WROOM-02.P$2 53.43,47.38 54.06,48.01 55.11,48.01 ESP-WROOM-02-BREAK.P$2 56.55,50.67 55.64,51.59 47.48,51.59 45.83,53.24 45.83,58.17 47.46,59.79 47.46,61.72 48.04,62.31 49.26,62.31 50.58,63.63 50.58,66.85 48.84,68.6 ESP-12.3 48.84,73.33 49.15,73.64 57,73.64 57.23,73.4 R4.2
FAN  (via drill 0.4)
  Top 0.203: ESP-WROOM-02-BREAK.P$8 44.43,46.33 ESP-WROOM-02.P$8 v44.43,42.09 v44.44,42.09 | v45.17,51.13 44.84,51.46 ESP-12.18 | R17.1 34.85,28.88 34.01,28.04 30.79,28.04 30.33,27.58 30.33,20.34 v29.72,19.74 | R2.2 34.8,25.17 35.64,24.33 35.64,23.82 39.19,20.27 39.19,17.73 | T5.TP 61.72,9.45 59.46,11.71 56.99,11.71 IO0.4 55.5,13.64 51.44,17.7 39.22,17.7 39.19,17.73 | 39.19,17.73 39.19,16.41 v38.33,15.54
  Bottom 0.203: ESP-WROOM-02-BREAK.P$8 41.31,50.78 42.35,51.82 44.49,51.82 v45.17,51.13 | v29.72,19.74 30.66,18.8 34.95,18.8 | 34.95,18.8 37.92,18.8 39.19,17.53 39.19,16.61 38.33,15.75 v38.33,15.54 | v44.44,42.09 42.95,40.6 42.95,32.89 43.16,32.69 43.16,31.95 34.95,23.75 34.95,18.8 | IO0.4 57.05,14.76 57.05,19.02 IO0.1
GND  (via drill 0.4)
  Top 0.152: FAN_ON.1 21.01,10.72 21.01,10.92
  Top 0.203: 24.36,14.78 24.26,14.68 | 35.7,37.57 35.7,38.42 34.61,39.51 34.1,39.51 Q6.2 R14.1 | 35.7,37.57 35.7,35.55 35.43,35.27 34.46,35.27 R16.1 30,34.09 27.89,31.98 27.89,25.3 26.96,24.37 | 44.14,81.07 IC1.P$3 44.45,80.86 44.45,77.6 43.97,77.11 43.4,77.11 C2.- | WELL_TEMP.2 32.78,80.95 33.86,80.95 34.72,81.81 37.31,81.81 RD2.2 39.12,79.76 RT.2 40.74,78.23 41.96,77.01 42.56,77.01 C2.- | 38.72,54.68 ESP-12.15 | ESP-WROOM-02.P$18 56.42,26.73 ESP-WROOM-02-BREAK.P$18 59.5,24.46 v61.44,24.46 | 48.39,35.33 ESP-WROOM-02.P$19 47.43,34.37 45.56,34.37 45.34,34.59 | JACK.RING 5.85,69.56 Q4.2 3.6,75.18 v2.77,74.35 1.14,75.97 v1.14,78.23 6.33,78.23 v10.44,82.35 | R18.1 29.79,30.71 29.11,30.02 29.11,21.64 28.32,20.85 27.86,20.85 27.56,20.55 Q3.2 | R8.1 31.37,27.15 30.94,26.72 30.94,22.14 C4.- | 28.91,14.8 C3.P$M | 38.77,46.89 34.44,46.89 R7.1 33.27,46.91 v33.1,47.09 | SERIAL4.4 45.72,4.7 T4.TP 40.69,1.78 v40.31,2.95 40.13,2.77 v26.59,2.77 26.36,2.54 v16.71,2.54 16.18,3.07 v13.01,3.07 9.02,7.06 v4.55,7.06 | RST.2 45.82,22.66 | 45.82,22.66 45.82,23.48 ESP-WROOM-02-BREAK.P$13 | R9.1 56.7,74.4 IC2.P$9 53.16,74.4 v52.55,75.01 51.94,74.4 IC2.P$8 IC2.P$7 48.22,75.67 C1.1 46.65,74.84 46.25,75.23 46.25,78.66 v46.48,78.89 | R5.1 31.73,63.58 30.23,62.08 | 30.23,62.08 v27.53,59.38 | R6.1 Q5.2 32.11,58.37 31.62,58.85 31.62,60.68 30.23,62.08 | v44.11,73.97 44.11,75.95 43.84,76.22 43.34,76.22 C2.- | v24.99,10.01 24.99,14.68 | v24.66,82.75 22.02,80.11 v22.02,79.2 | v44.96,34.98 45.34,34.59 | 3.25,56.08 ATX.24 | 36.58,71.73 36.58,71.7 v35.1,70.23 33.15,70.23 32.64,69.72 32.64,67.87 v33.76,66.75
  Top 0.203: 46.25,33.15 45.34,33.15 45.34,34.59 | v36.93,37.57 35.7,37.57 | v40.13,22.45 40.34,22.66 45.82,22.66 | v56.34,1.5 56.34,5.84 57,6.5 59.46,6.5 v59.49,6.53
  Top 0.406: 6.66,62.08 6.65,62.08 6.65,62.04 6.29,62.04 JACK.RING_SW
  Top 0.813: Q3.2 26.7,20.55 25.81,21.44 23.29,21.44 v22.07,20.22
  Top 1.27: CP2.1 55.56,46.86 v54.72,46.86 | ESP-12.15 38.84,49.52 ESP-WROOM-02-BREAK.P$9 38.77,46.89 38.77,45.13 40.03,43.88 ESP-WROOM-02.P$9 | ESP-WROOM-02-BREAK.P$13 47.43,25.09 ESP-WROOM-02.P$13 | ESP-WROOM-02.P$19 48.19,35.13 v48.19,32.54 | 21.01,10.92 21.01,15.49 v20.75,15.75 | Q2.2 26.96,24.37 26.67,24.66 21.72,24.66 v20.52,23.47 | v36.96,71.09 36.58,71.48 36.58,71.73 CP1.2 | 46.08,37.54 50.55,37.54 50.55,33.15 46.25,33.15 46.25,37.24
  Top 2.54: C3.P$M 24.99,14.68 24.26,14.68 21.82,14.68 v20.75,15.75 | REG.1 30.48,9.3 28.79,10.99 C3.P$M | C3.P$M 28.79,15.69 C4.-
  Top 5.08: JACK.RING 3.39,63.69 4.68,62.4 JACK.RING_SW | 3.25,56.08 3.25,57.38 6.3,60.43 6.3,62.38 | 3.45,66.57 3.3,66.73 3.02,66.73 3.38,67.08 3.38,68.22 3.61,68 3.61,67.11 | 4.39,63.09 4.57,62.92 5.82,62.92 6.66,62.08 6.66,62.03
  Bottom 0.203: 26.06,66.8 28.3,64.57 28.3,60.15 v27.53,59.38 25.09,59.38 22.89,57.17 v22.89,54.97 | 15.39,32.18 15.51,32.07 16.14,32.07 | 36.25,9.3 45.75,9.3 SERIAL6.6 | 36.25,9.3 30.63,9.3 24.18,15.75 v20.75,15.75 | SERIAL6.6 SERIAL4.4 | SERIAL6.6 45.82,9.94 RST.3 43.97,15.05 43.97,18.72 RST.2 | 46.25,78.66 v46.48,78.89 44.11,76.53 v44.11,73.97 | v52.55,75.01 54.56,75.01 v59.66,80.11 58.06,80.11 56.77,81.41 v56.77,84.53 | IO0.3 58.27,14.75 58.27,20.55 | 58.27,20.55 58.27,23.23 ESP-WROOM-02-BREAK.P$18 | IO0.2 58.29,20.57 58.27,20.55 | v56.34,1.5 40.97,1.5 v40.31,2.95 | v50.62,39.78 48.53,39.78 48.32,39.98 | v54.72,46.86 55.46,47.6 v61.65,47.6 60.78,48.46 v60.78,52.22 | v40.46,59.56 40.46,60.58 42.98,63.09 | 42.98,63.09 v44.12,64.24 | v33.76,66.75 39.14,66.75 42.8,63.09 42.98,63.09 | v22.02,79.2 22.02,73.81 v25.63,70.21 23.27,67.84 v16.84,67.84 13.77,67.84 12.62,68.99 v12.62,71.5 8.48,71.5 3.48,66.5 3.48,67.01 JACK.RING 3.39,67.12 3.56,67.28 | WELL_TEMP.2 30.73,83.82 32.08,85.17 36.52,85.17 v36.75,84.94 | 6.48,62.38 6.46,62.4 JACK.RING_SW | 53.52,44.5 53.52,43.88 | v52.73,22.91 52.73,25.98 | v18.8,60.22 18.52,59.94 18.52,59.26 | v16.05,15.44 15.75,15.75 14.58,15.75 | v37.49,28.27 36.93,28.83 v36.93,37.57 | v36.12,14.22 36.12,9.43 36.25,9.3
  Bottom 1.27: Q1.S 18.43,32.3 15.28,32.3 | 30.76,78.87 28.75,78.87 27.64,77.75 27.64,68.38 26.06,66.8 18.52,59.26 17.78,58.52 14.55,58.52 13.97,57.94 13.97,57.72 | WELL_TEMP.2 30.73,78.9 30.76,78.87 | ESP-WROOM-02-BREAK.P$18 57.16,25.98 52.73,25.98 48.32,25.98 | ESP-WROOM-02-BREAK.P$13 48.32,25.98 | 48.32,25.98 48.36,26.02 | v48.19,32.54 48.32,32.41 | 48.32,32.41 48.32,25.98 | v54.72,46.86 54.72,44.55 54.05,43.88 53.52,43.88 48.32,43.88 | ESP-WROOM-02-BREAK.P$9 38.77,45.13 40.03,43.88 48.32,43.88 | 48.32,43.88 48.32,39.98 48.32,32.41 | v20.75,15.75 22.07,17.07 v22.07,20.22 20.52,21.77 v20.52,23.47 | 30.76,78.87 34.59,78.87 36.14,77.32 36.14,71.91 v36.96,71.09
  Bottom 2.54: 14.07,33.43 13.97,33.53 | 12.47,15.75 13.66,15.75 14.58,15.75 v20.75,15.75 | 53.47,44.5 53.52,44.5 53.52,45.36
  Bottom 5.08: 13.97,35.1 13.97,57.72 10.93,60.76 7.93,60.76 JACK.RING_SW 6.25,62.36 | 13.97,35.1 13.97,33.6 | 13.97,33.6 13.97,33.53 13.97,18.3 | 13.97,35.1 ATX.7 ATX.19 ATX.18 ATX.17 ATX.5 13.59,26.7 13.59,27.15 | ATX.15 ATX.3 13.97,18.3 | ATX.24 3.25,57.4 6.25,60.4 6.25,62.36 | 15.39,32.18 15.28,32.3 13.97,33.6 | 13.59,32.51 13.74,32.36 15.85,32.36 16.14,32.07 16.56,31.65 20.3,31.65 | 13.97,18.3 13.97,16.05 13.66,15.75 | 3.3,66.98 3.56,66.98 3.56,67.28 3.23,67.28 | 5.97,62.38 6.48,62.38 6.48,62.61 | 3.35,67.06 3.35,63.75 4.75,62.36 6.25,62.36
  pour Top (isolate 0.254): 0.5,85.5 62.5,85.5 62.5,71 53.5,71 53.5,54 62.5,54 62.5,46 53,46 53,26 62.5,26 62.5,0.5 0.5,0.5
  pour Bottom (isolate 0.254): 0.5,85.5 62.5,85.5 62.5,71 53.5,71 53.5,54 62.5,54 62.5,46 53,46 53,26 62.5,26 62.5,0.5 0.5,0.5
HEATER  (via drill 0.4)
  Top 0.203: ESP-WROOM-02-BREAK.P$6 47.43,48.41 ESP-WROOM-02.P$6 47.43,42.29 v46.82,41.68 46.37,41.22 40.77,41.22 36.27,45.72 R7.2 | ESP-12.16 v40.84,51.93 | R15.1 35.81,32.31 36.88,31.24 36.88,30.71 38.56,29.03 38.56,27.86 37.92,27.23 37.92,26.02 v38.24,25.7
  Bottom 0.203: v40.84,51.93 41.59,52.68 45.81,52.68 46.39,52.09 ESP-WROOM-02-BREAK.P$6 | v46.82,41.68 45.39,41.68 43.56,39.85 43.56,33.22 43.81,32.97 43.81,31.7 38.24,26.12 v38.24,25.7
HEATER_TEMP  (via drill 0.4)
  Top 0.203: HEATER_TEMP.2 32.18,77.93 v32.18,80.16 34.16,80.16 34.95,80.95 35.79,80.95 38.51,78.23 RT.1 | IC2.P$5 48.39,78.21 v46.58,80.01
  Bottom 0.203: v32.18,80.16 34.16,80.16 34.95,80.95 35.79,80.95 37.95,78.79 37.95,76.63 41.53,73.05 42.8,73.05 43.18,73.43 43.18,78.13 45.06,80.01 v46.58,80.01
HIGH_TEMP  (via drill 0.4)
  Top 0.203: 46.84,71 ESP-12.4 | ESP-12.4 46.84,68.61 49.11,66.34 v49.11,64.59 | ESP-12.4 46.84,72.02 45.67,73.19 45.67,80.4 IC1.P$4 | v42.33,32.28 43.27,31.34 52.46,31.34 53.43,30.37 ESP-WROOM-02.P$17 53.66,26.5 53.66,25.86 54.34,25.17 55.43,25.17 ESP-WROOM-02-BREAK.P$17 56.3,24.05 MODE.2 | R8.2 35.74,27.15 36.4,26.49 36.4,24 39.8,20.6 39.8,19.46 40.95,18.31 50.11,18.31 52.37,20.57 MODE.2 | T7.TP 61.72,13.92 60.91,14.73 55.37,14.73 52.76,17.35 52.76,20.51 MODE.2
  Bottom 0.203: v49.11,64.59 49.44,64.59 51.6,62.43 51.6,54.79 51.09,54.28 36.99,54.28 36.43,53.72 36.43,51.94 37.7,50.67 37.7,44.76 42.33,40.13 v42.33,32.28 | MODE.2 51.26,19.01 51.26,14.76 MODE.3
MODE  (via drill 0.4)
  Top 0.203: ESP-WROOM-02-BREAK.P$16 53.53,24.05 51.93,25.65 ESP-WROOM-02.P$16 51.93,30.3 51.5,30.73 42.58,30.73 41.28,32.03 v41.28,33.07 | v50.76,61.54 51.8,62.59 51.8,67.64 50.84,68.6 ESP-12.2 50.84,72.05 51.16,72.36 v51.98,72.36 | R9.2 59.64,74.93 v60.33,74.24
  Bottom 0.203: v50.76,61.54 50.99,61.32 50.99,55.35 50.51,54.86 36.59,54.86 35.82,54.1 35.82,51.61 37.09,50.34 37.09,44.45 41.72,39.83 41.72,33.5 v41.28,33.07 | v51.98,72.36 59.72,72.36 60.33,72.97 v60.33,74.24
N$1  (via drill 0.4)
  Top 0.203: 40.79,83.41 RL2.1 41.43,84.35 v41.73,84.35 | RL1.2 40.64,75.77 40.87,75.54 41.48,75.54 41.55,75.46 41.55,74.57 v42.16,73.97
  Bottom 0.203: v42.16,73.97 39.88,76.25 39.88,83.8 40.44,84.35 v41.73,84.35
N$2
  Top 1.27: Q2.3 22.68,23.04 21.08,21.44 19.85,21.44 HEATER_POWER.2
N$3  (via drill 0.4)
  Top 0.152: 18.54,55.63 18.91,55.99 22.61,59.69 v22.61,59.77 | v18.41,49.35 18.41,44.02 v18.67,43.76 18.64,43.74 18.54,43.74 | v22.73,39.34 22.94,39.14 22.94,38.56 | v22.28,35.99 22.3,35.97 23.37,35.97 HEATSINK.P$1
  Top 0.203: 18.54,55.63 v18.57,55.6
  Top 2.54: Q1.D HEATSINK.P$1 22.94,35.97 22.94,38.56 22.94,39.27 18.54,43.66 18.54,43.74 18.54,55.63 RELAY.P$5
  Bottom 0.152: v22.61,59.77 25.93,63.09 26.01,63.09
  Bottom 2.54: Q1.D 22.94,35.97 | 22.94,35.97 25.05,35.97 25.05,35.94 | 22.94,35.97 22.94,39.27 18.54,43.66 18.54,55.63 26.01,63.09 RELAY.P$5
N$4
  Top 0.152: 20.98,8.43 FAN_ON.2
  Top 0.203: 20.47,9.53 20.83,9.17 FAN_ON.2
  Top 0.813: Q3.3 23.42,17.7 19.66,17.7 18.11,16.15 18.11,14.38 18.95,13.54 18.95,7.39
  Top 1.524: FAN.3 18.95,7.39 20.22,7.39 20.98,8.15 20.98,8.43
N$5
  Top 0.203: Q1.G 17.91,38.51 16.94,37.54 16.94,32.84 17.93,31.85 25.86,31.85 30.85,36.85 31.27,36.85 | Q6.3 33.98,37.61 R13.1 33.16,36.8 33.12,36.85 31.98,36.85 | 31.98,36.85 31.27,36.85 | R14.2 32.56,42.16 31.98,41.58 31.98,36.85 | 31.24,36.87 31.27,36.85
N$6
  Top 5.08: RELAY.P$8 24.47,48.06 28.71,48.06 PEL_RED.1
N$7
  Bottom 5.08: PEL_BLK.1 17.53,77.81 RELAY.P$1
N$8
  Top 0.203: R18.2 34.01,29.92 34.01,29.67 R17.2 30.2,28.93 29.72,28.45 29.72,21.08 Q3.1
N$27  (via drill 0.4)
  Top 0.203: RH.1 40.76,81.67 40.86,81.67 41.5,81.03 v41.86,81.03 | IC1.P$2 43.13,82.07 v43.03,82.17
  Bottom 0.203: v41.86,81.03 41.88,81.03 v43.03,82.17
N$30
  Top 0.203: R12.2 33.3,43.94 34.16,43.08 35.94,43.08 36.55,42.47 36.55,40.79 36.27,40.51 Q6.1
N$32
  Top 0.203: R16.2 34.8,33.83 R15.2 29.26,32.31 28.5,31.55 28.5,23.24 Q2.1
N$33
  Top 0.203: Q4.3 8.15,73.14 9.78,74.78 9.78,76.26 D1.1
  Top 0.813: RELAY.P$3 16.87,71.55 16.87,75.03 15.17,76.73 D1.1
N$34
  Top 0.203: Q4.1 7.63,76.72 R10.2
N$35
  Top 0.203: Q5.1 35.74,59.18 35.74,60.86 R11.1
N$36
  Top 0.203: D2.1 31.77,54.07 Q5.3
  Top 0.813: RELAY.P$7 26.78,54.07 D2.1
N$92
  Top 0.203: IC2.P$6 47.96,76.94 C1.2
PEL_PWM  (via drill 0.4)
  Top 0.203: ESP-12.19 46.85,57.86 v47.15,58.17 | ESP-WROOM-02.P$10 41.45,26.73 41.26,26.54 | ESP-WROOM-02-BREAK.P$10 41.26,26.54 | 41.26,26.54 41.26,27.28 37.5,31.04 37.5,36.2 38.47,37.16 v38.47,37.34 38.47,41.59 36.12,43.94 34.95,43.94
  Top 0.381: R12.1 34.95,43.94
  Bottom 0.203: v47.15,58.17 46.9,57.91 35.01,57.91 32.78,55.68 32.78,49.68 34.05,48.41 34.05,42.27 38.47,37.85 v38.47,37.34
PEL_SWA  (via drill 0.4)
  Top 0.203: ESP-WROOM-02.P$4 50.43,48.41 ESP-WROOM-02-BREAK.P$4 | v40.57,45.59 39.84,46.33 39.84,56.14 40.41,56.72 41.45,56.72 45.62,60.88 45.62,62.61 47.73,64.72 47.73,65.51 46.25,66.98 43.99,66.98 43,67.97 v42.85,67.97 42.84,67.98 ESP-12.6 | 31.55,74.4 29.44,74.4 28.42,75.41 23.16,75.41 18.52,80.06 9.19,80.06 R10.1 | 31.55,74.4 31.55,76.33 35.31,80.09 v35.36,80.09 | 31.55,74.4 31.55,65.51 32.23,64.82 33.55,64.82 R5.2
  Bottom 0.203: v40.57,45.59 50.84,45.59 51.24,46 51.24,49.22 ESP-WROOM-02-BREAK.P$4 | v35.36,80.09 37.34,78.11 37.34,72.59 41.96,67.97 v42.85,67.97
PEL_SWB  (via drill 0.4)
  Top 0.203: ESP-WROOM-02.P$5 ESP-WROOM-02-BREAK.P$5 | 40.84,69.96 ESP-12.7 40.84,68.76 | 37.4,52.55 37.4,55.83 37.86,56.29 38.87,56.29 39.91,57.33 41.05,57.33 45.01,61.29 45.01,62.92 46.86,64.77 46.86,65.41 45.9,66.37 43.23,66.37 40.84,68.76 | 37.4,52.55 37.4,52.17 v37.37,52.15 37.37,52.53 37.4,52.55 | 40.84,68.76 40.76,68.83 36.37,68.83 35.87,68.33 35.87,62.97 35.59,62.69 34.16,62.69 R11.2 R6.2
  Bottom 0.203: ESP-WROOM-02-BREAK.P$5 48.93,48.79 47.51,47.37 41.54,47.37 40.24,48.67 40.24,50.72 39.58,51.38 38.14,51.38 v37.37,52.15
RESET  (via drill 0.4)
  Top 0.203: RST.1 43.15,18.92 49.63,18.92 50.22,19.51 50.22,22.8 ESP-WROOM-02-BREAK.P$15 50.43,25.09 ESP-WROOM-02.P$15 50.43,29.64 49.95,30.12 42.23,30.12 40.42,31.93 40.42,33.83 v40.73,34.14 | ESP-12.1 52.84,61.36 52.08,60.6 v50.12,60.6 | 34.11,22.76 34.24,22.63 35.76,22.63 38.58,19.81 38.58,17.32 37.16,15.9 37.16,15.19 37.72,14.63 40.07,14.63 RST.4 42.3,13.21 T6.TP
  Top 0.381: 34.11,22.76 R1.2
  Bottom 0.203: v50.12,60.6 50.38,60.35 50.38,55.8 50.05,55.47 36.26,55.47 35.22,54.43 35.22,51.21 36.48,49.94 36.48,44.09 41.16,39.42 41.16,34.57 v40.73,34.14 | RST.4 43.33,15.04 43.33,18.74 RST.1
RXD  (via drill 0.4)
  Top 0.203: ESP-WROOM-02-BREAK.P$11 41.31,24.39 42,25.07 43.47,25.07 44.43,26.03 ESP-WROOM-02.P$11 44.44,27.91 44.05,28.3 41.23,28.3 38.11,31.42 38.11,35.43 v38.52,35.84 | ESP-12.21 50.84,58.39 50.48,58.75 49.08,58.75 48.63,59.21 48.63,60.53 v48.88,60.78 | SERIAL4.2 50.8,4.7 T2.TP
  Bottom 0.203: 48.63,60.53 v48.88,60.78 48.09,59.99 48.09,57.63 47.76,57.3 35.34,57.3 33.39,55.35 33.39,50.06 34.66,48.79 34.66,42.77 39.33,38.1 39.33,36.65 v38.52,35.84 | SERIAL4.2 51.18,7.11 SERIAL6.3 50.65,12.72 50.65,21.31 49.58,22.38 42.98,22.38 ESP-WROOM-02-BREAK.P$11
SCLK  (via drill 0.4)
  Top 0.203: ESP-12.5 v44.84,67.92 46.35,67.92 48.28,65.99 48.28,64.36 46.23,62.31 46.23,60.48 41.84,56.09 41.84,51.92 v42.81,50.95 | ESP-WROOM-02.P$3 51.93,47.37 ESP-WROOM-02-BREAK.P$3 | IC2.P$13 53.11,79.48 v51.99,78.36
  Bottom 0.203: v42.81,50.95 42.81,48.67 43.34,48.13 47.13,48.13 47.84,48.84 47.84,50.19 48.22,50.57 52.89,50.57 ESP-WROOM-02-BREAK.P$3 | v51.99,78.36 51.54,78.82 48.51,78.82 45.97,76.28 45.97,69.05 v44.84,67.92
SDIO  (via drill 0.4)
  Top 0.203: ESP-WROOM-02.P$7 45.93,47.37 ESP-WROOM-02-BREAK.P$7 43.85,51.74 42.84,52.75 ESP-12.17 42.84,56.09 43.14,56.39 44.49,56.39 45.2,57.1 45.2,58.37 46.85,60.02 46.85,61.98 47.79,62.92 48.91,62.92 49.97,63.98 49.97,66.45 47.86,68.56 47.86,72.16 v46.8,73.23 | 54.71,80.75 IC2.P$14 55.5,80.75 56.34,79.91 56.34,79.13 R3.2 | 54.71,80.75 53.57,80.75 v53.06,81.25 | 54.74,80.72 54.71,80.75
  Bottom 0.203: v53.06,81.25 53.06,77.9 52.45,77.29 51.33,77.29 51.05,77.57 48.16,77.57 46.66,76.07 46.66,73.37 v46.8,73.23
TXD  (via drill 0.4)
  Top 0.203: ESP-WROOM-02-BREAK.P$12 44.66,24.05 45.93,25.32 ESP-WROOM-02.P$12 45.93,28.57 45.96,28.6 45.65,28.91 41.56,28.91 38.72,31.75 38.72,34.75 v39.56,35.59 | ESP-12.22 52.84,58.75 51.98,59.61 v49.54,59.61 | T1.TP 48.26,4.7 SERIAL4.3 48.64,5.44 50.57,7.37 53.98,7.37 SERIAL6.2
  Bottom 0.203: v49.54,59.61 48.7,58.78 48.7,57.2 48.19,56.69 35.67,56.69 34,55.02 34,50.44 35.27,49.17 35.27,43.26 39.94,38.58 39.94,35.97 v39.56,35.59 | SERIAL6.2 57.66,11.05 57.66,21.06 56.77,21.95 51.03,21.95 49.96,23.01 44.76,23.01 43.85,23.91 ESP-WROOM-02-BREAK.P$12
WELL_TEMP  (via drill 0.4)
  Top 0.203: RH.2 39.12,82.73 | 39.12,82.73 RL2.2 | 39.12,82.73 33.54,82.73 WELL_TEMP.1 | IC2.P$3 49.66,80.75 48.39,82.02 48.39,83.34 47.78,83.95 43.71,83.95 v43,83.24
  Bottom 0.203: WELL_TEMP.1 33.54,82.73 37.59,82.73 40.03,85.17 42.44,85.17 42.85,84.76 42.85,83.44 v43,83.24

### Text on the board
tPlace: WELL_TEMP | IC1 | RL2 | PEL / BLK | RH | RD2 | IC2 | D1 | RT | C1 | R10 | RL1 | C2 | R3 | R9 | RD1 | Q4 | HEATER / TEMP | CP1 | R4 | R5 | R11 | R6 | ESP-12 | Q5 | RELAY | D2 | PEL / RED | HEATSINK | R7 | CP2 | R12 | * | R14 | Q6 | R13 | Q1 | R16 | R15 | * | R18 | R17 | * | ESP-WROOM-02 | R8 | HEATER / POWER | R2 | Q2 | R1 | C4 | Q3 | T7 | REG | T6 | C3 | ON | T5 | FAN | + | T4 | T1 | T2 | T3 | NinjaPCB-4x4-NinNin ver2.0
bPlace: RST | MODE | IO0 | SERIAL6 | ATX | NinjaPCB-4x4-NinNin ver2.0 | SERIAL4 | https://github.com/hisashin/NinjaPCR
tDocu: 63 x 86 mm